# EAGLE design Arduino_NMEA_TestBoard (EAGLE 9.5.2)

## Sheet 1 of 2
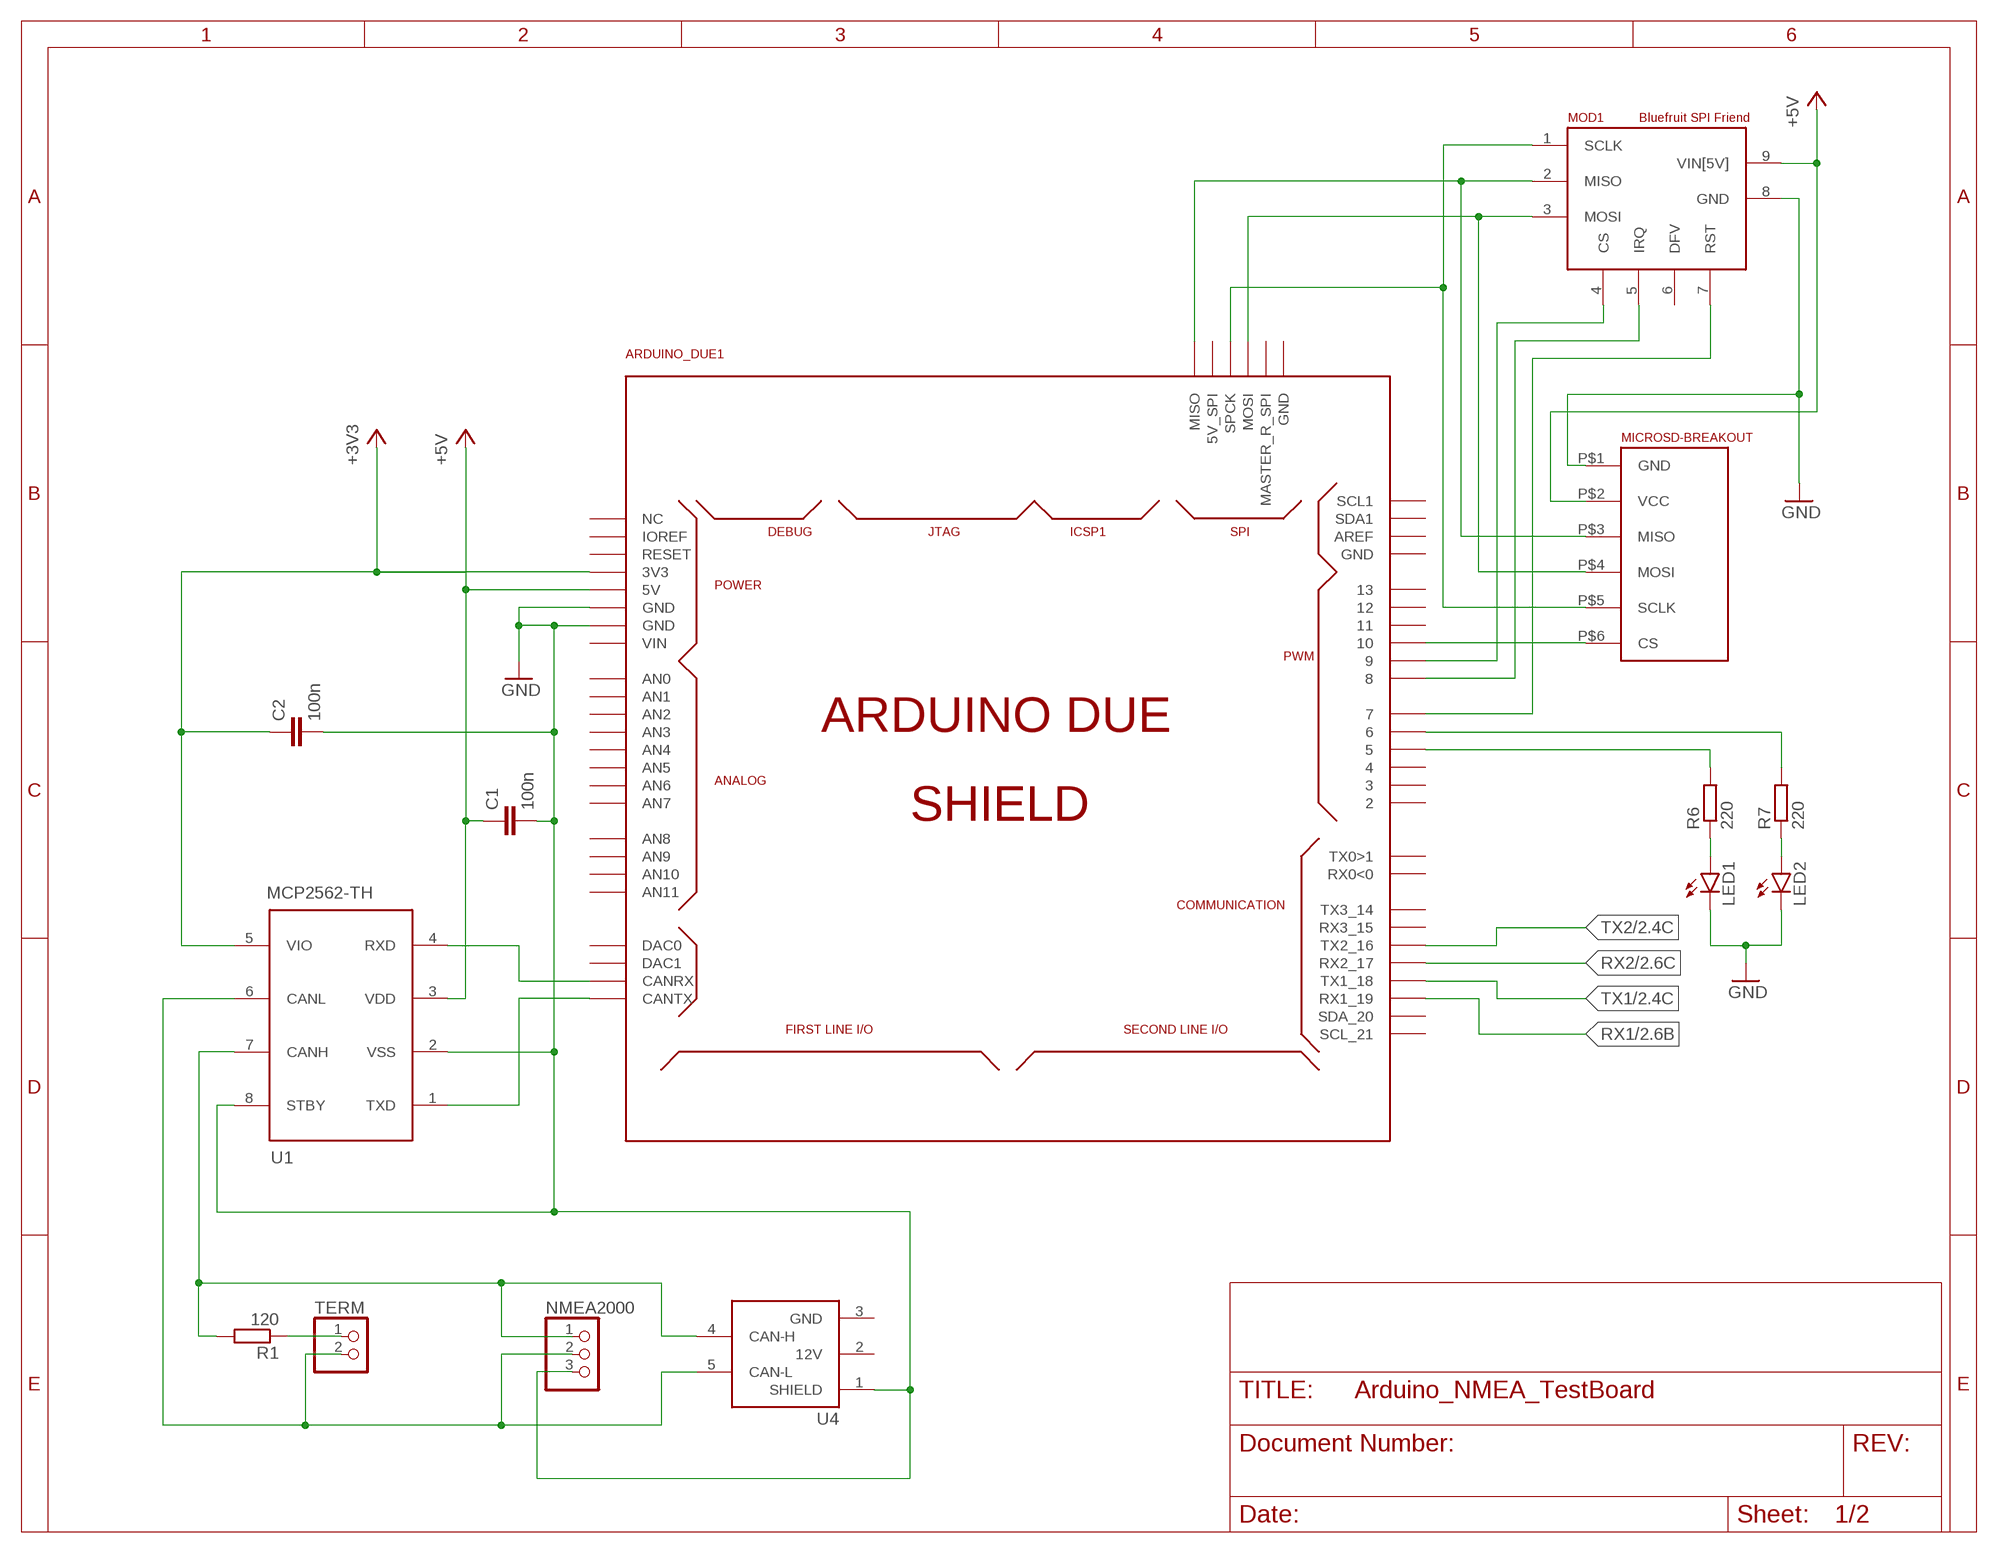
[diagram p0: schematic, sheet 1]

### Parts
ARDUINO_DUE1  ARDUINO_DUE_SHIELD  [ARDUINO_DUE_SHIELD]
C1  100n  C-EU050-025X075  [C050-025X075]
C2  100n  C-EU050-025X075  [C050-025X075]
LED1  LED5MM  [LED5MM]
LED2  LED5MM  [LED5MM]
MICROSD-BREAKOUT  MICROSD-BREAKOUT  [MICROSD-BREAKOUT]
MOD1  BLUEFRUIT-SPI-FRIEND  [BLE_SPIFRIEND]
NMEA2000  PINHD-1X3  [1X03]
R1  120  R-EU_0207/10  [0207/10]
R6  220  R-EU_0207/10  [0207/10]
R7  220  R-EU_0207/10  [0207/10]
TERM  PINHD-1X2  [1X02]
U1  MCP2562-TH  [DIP8]
U4  NMEA2000-TOPSIDE  [NMEA2000-TOPSIDE]

### Nets
+3V3: ARDUINO_DUE1.3V3 C2.1 U1.5(VIO) ; also sheet 2
+5V: ARDUINO_DUE1.5V0(5V) C1.1 MICROSD-BREAKOUT.P$2(VCC) MOD1.9(VIN[5V]) U1.3(VDD) ; also sheet 2
GND: ARDUINO_DUE1.GND ARDUINO_DUE1.GND_1(GND) C1.2 C2.2 LED1.K(C) LED2.K(C) MICROSD-BREAKOUT.P$1(GND) MOD1.8(GND) NMEA2000.3 U1.2(VSS) U1.8(STBY) U4.1(SHIELD) ; also sheet 2
N$2: ARDUINO_DUE1.SPCK MICROSD-BREAKOUT.P$5(SCLK) MOD1.1(SCLK)
N$3: ARDUINO_DUE1.CANRX U1.4(RXD)
N$4: ARDUINO_DUE1.CANTX U1.1(TXD)
N$5: NMEA2000.2 TERM.2 U1.6(CANL) U4.5(CAN-L)
N$6: NMEA2000.1 R1.2 U1.7(CANH) U4.4(CAN-H)
N$7: ARDUINO_DUE1.MISO MICROSD-BREAKOUT.P$3(MISO) MOD1.2(MISO)
N$8: ARDUINO_DUE1.MOSI MICROSD-BREAKOUT.P$4(MOSI) MOD1.3(MOSI)
N$10: R1.1 TERM.1
N$12: ARDUINO_DUE1.10 MICROSD-BREAKOUT.P$6(CS)
N$13: ARDUINO_DUE1.9 MOD1.4(CS)
N$14: ARDUINO_DUE1.8 MOD1.5(IRQ)
N$15: ARDUINO_DUE1.7 MOD1.7(RST)
N$25: ARDUINO_DUE1.5 R6.2
N$27: ARDUINO_DUE1.6 R7.2
N$31: LED1.A R6.1
N$32: LED2.A R7.1
RX1: ARDUINO_DUE1.19(RX1_19) ; also sheet 2
RX2: ARDUINO_DUE1.17(RX2_17) ; also sheet 2
TX1: ARDUINO_DUE1.18(TX1_18) ; also sheet 2
TX2: ARDUINO_DUE1.16(TX2_16) ; also sheet 2
Unconnected: ARDUINO_DUE1.0(RX0<0) ARDUINO_DUE1.1(TX0>1) ARDUINO_DUE1.2 ARDUINO_DUE1.3 ARDUINO_DUE1.4 ARDUINO_DUE1.5V_2(5V_SPI) ARDUINO_DUE1.11 ARDUINO_DUE1.12 ARDUINO_DUE1.13 ARDUINO_DUE1.14(TX3_14) ARDUINO_DUE1.15(RX3_15) ARDUINO_DUE1.20(SDA_20) ARDUINO_DUE1.21(SCL_21) ARDUINO_DUE1.A0(AN0) ARDUINO_DUE1.A1(AN1) ARDUINO_DUE1.A2(AN2) ARDUINO_DUE1.A3(AN3) ARDUINO_DUE1.A4(AN4) ARDUINO_DUE1.A5(AN5) ARDUINO_DUE1.A6(AN6) ARDUINO_DUE1.A7(AN7) ARDUINO_DUE1.A8(AN8) ARDUINO_DUE1.A9(AN9) ARDUINO_DUE1.A10(AN10) ARDUINO_DUE1.A11(AN11) ARDUINO_DUE1.AREF ARDUINO_DUE1.DAC0 ARDUINO_DUE1.DAC1 ARDUINO_DUE1.GND_4(GND) ARDUINO_DUE1.GND_5(GND) ARDUINO_DUE1.IOREF ARDUINO_DUE1.MASTER_RESET_SPI(MASTER_R_SPI) ARDUINO_DUE1.NC_2(NC) ARDUINO_DUE1.RESET ARDUINO_DUE1.SCL1 ARDUINO_DUE1.SDA1 ARDUINO_DUE1.VIN MOD1.6(DFV) U4.2(12V) U4.3(GND)

## Sheet 2 of 2
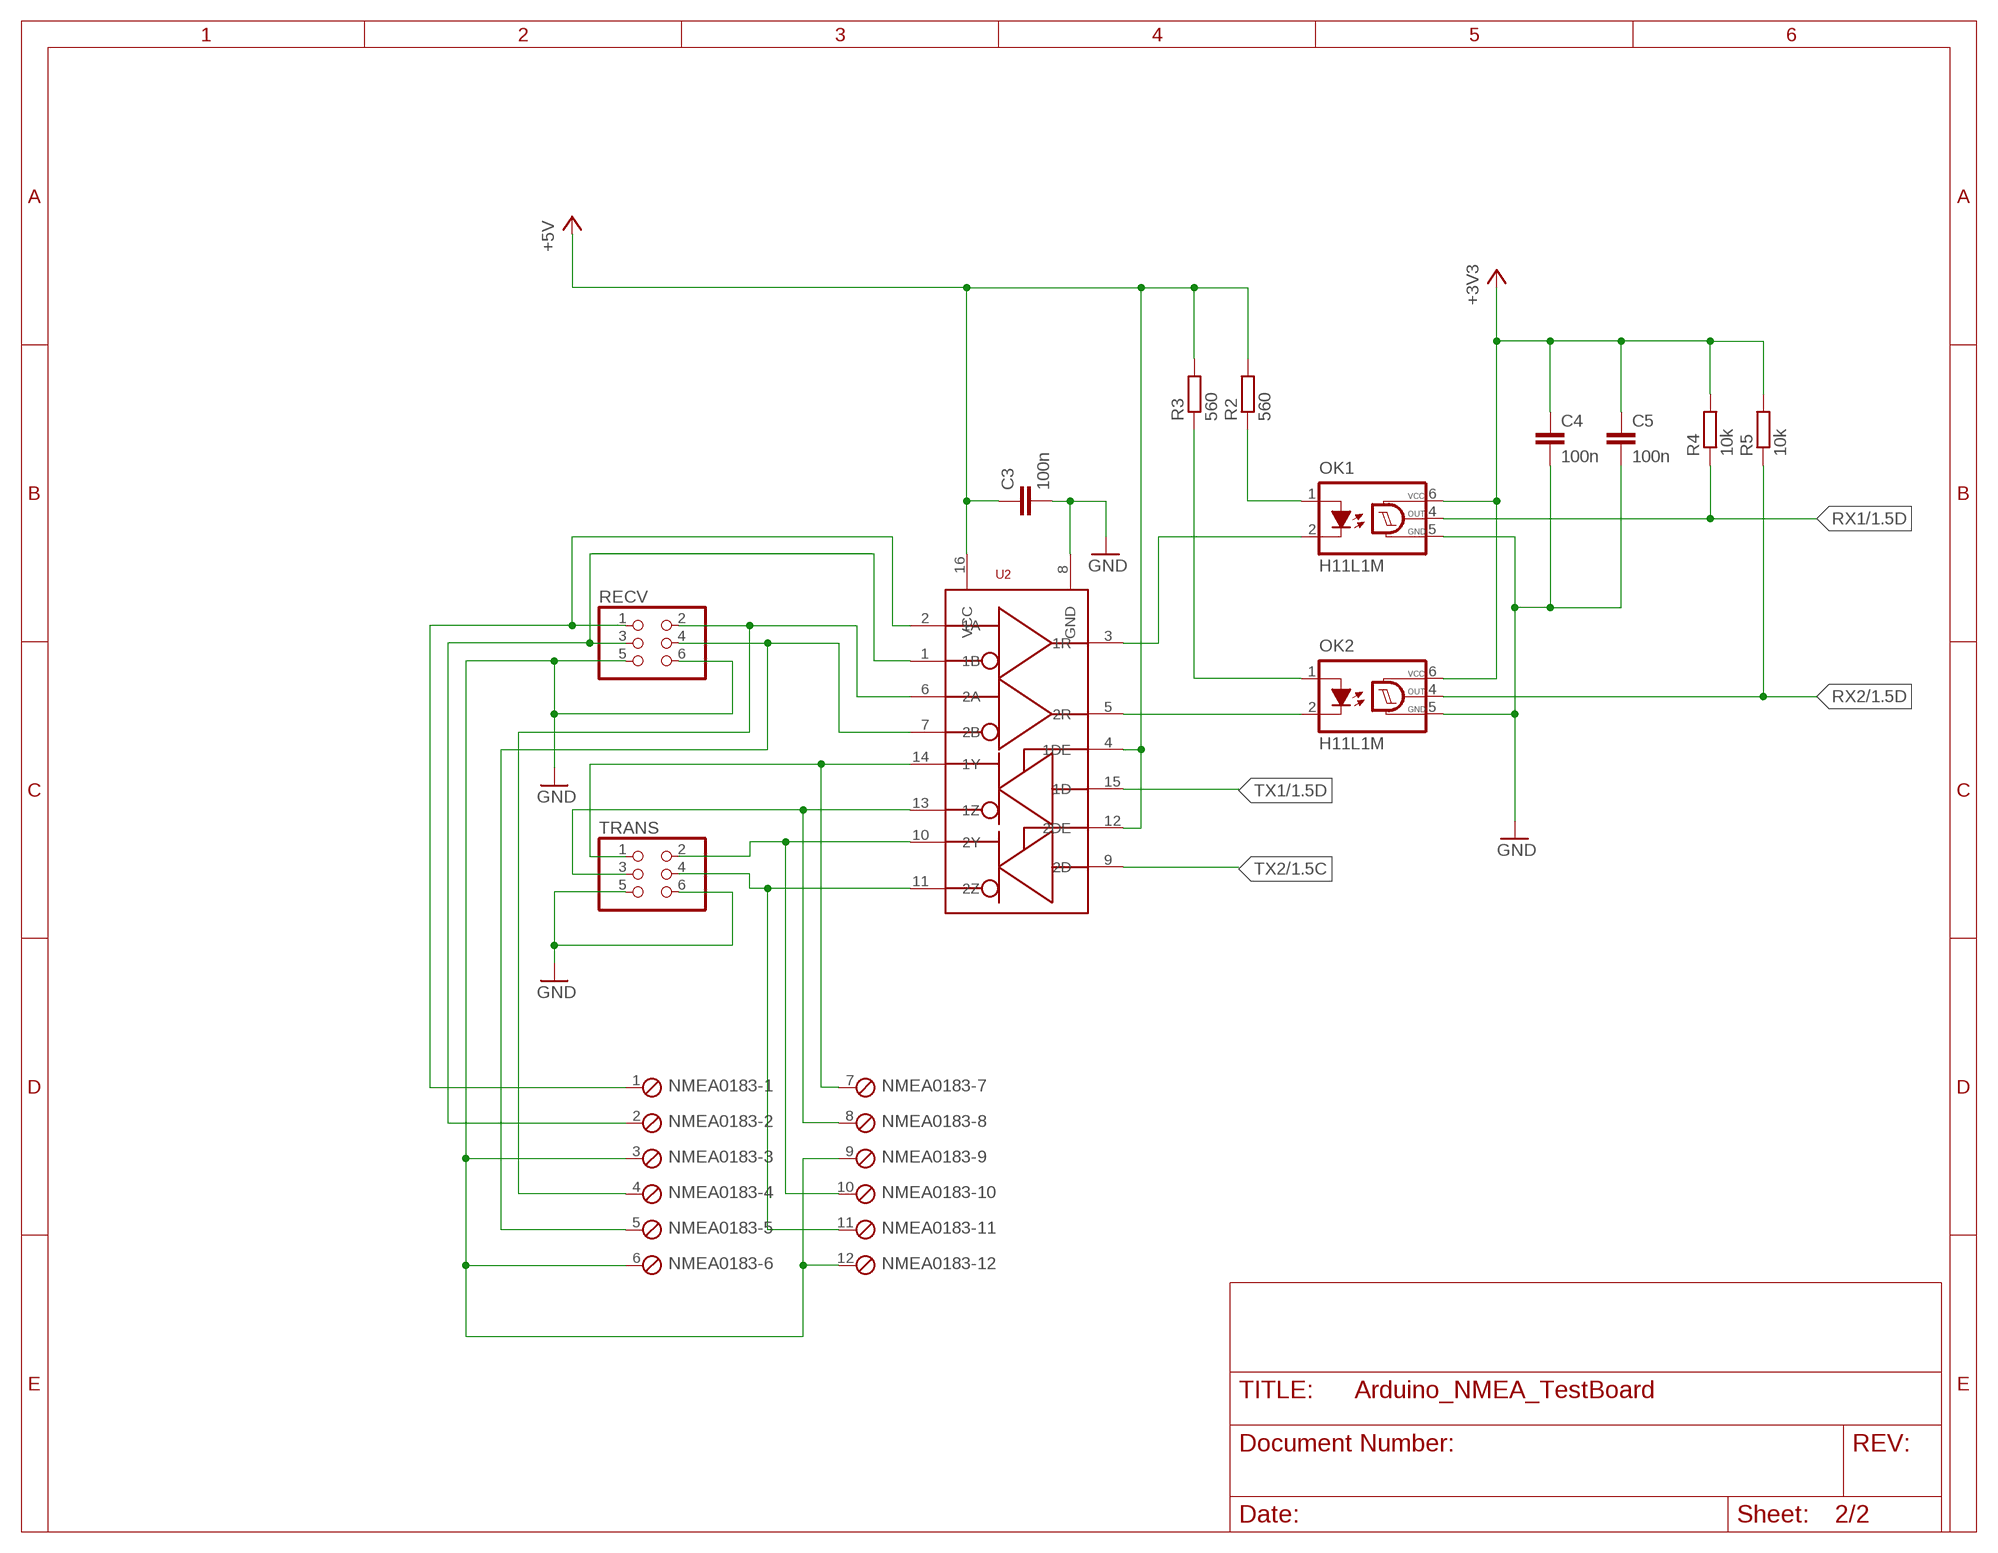
[diagram p1: schematic, sheet 2]

### Parts
C3  100n  C-EU050-025X075  [C050-025X075]
C4  100n  C-EU050-025X075  [C050-025X075]
C5  100n  C-EU050-025X075  [C050-025X075]
NMEA0183  MPT12  [12POL254]
OK1  H11L1M  [DIL06]
OK2  H11L1M  [DIL06]
R2  560  R-EU_0207/10  [0207/10]
R3  560  R-EU_0207/10  [0207/10]
R4  10k  R-EU_0207/10  [0207/10]
R5  10k  R-EU_0207/10  [0207/10]
RECV  PINHD-2X3  [2X03]
TRANS  PINHD-2X3  [2X03]
U2  SN65C1168  [DIP16]

### Nets
+3V3: C4.1 C5.1 OK1.6(VCC) OK2.6(VCC) R4.2 R5.2 ; also sheet 1
+5V: C3.1 R2.2 R3.2 U2.4(1DE) U2.12(2DE) U2.16(VCC) ; also sheet 1
GND: C3.2 C4.2 C5.2 NMEA0183.3 NMEA0183.6 NMEA0183.9 NMEA0183.12 OK1.5(GND) OK2.5(GND) RECV.5 RECV.6 TRANS.5 TRANS.6 U2.8(GND) ; also sheet 1
N$1: OK2.2(C) U2.5(2R)
N$17: OK1.2(C) U2.3(1R)
N$18: OK1.1(A) R2.1
N$19: OK2.1(A) R3.1
N$20: NMEA0183.1 RECV.1 U2.2(1A)
N$21: NMEA0183.2 RECV.3 U2.1(1B)
N$22: NMEA0183.4 RECV.2 U2.6(2A)
N$23: NMEA0183.5 RECV.4 U2.7(2B)
N$24: NMEA0183.8 TRANS.3 U2.13(1Z)
N$26: NMEA0183.10 TRANS.2 U2.10(2Y)
N$28: NMEA0183.7 TRANS.1 U2.14(1Y)
N$30: NMEA0183.11 TRANS.4 U2.11(2Z)
RX1: OK1.4(OUT) R4.1 ; also sheet 1
RX2: OK2.4(OUT) R5.1 ; also sheet 1
TX1: U2.15(1D) ; also sheet 1
TX2: U2.9(2D) ; also sheet 1

## Library data of the parts
ARDUINO_DUE1 = arduino_due_shield:ARDUINO_DUE_SHIELD
C1-C5 = rcl:C-EU: CAPACITOR, European symbol; SPICEPREFIX: C
LED1 LED2 = led:LED: LED OSRAM: - CHIPLED LG R971, LG N971, LY N971, LG Q971, LY Q971, LO R971, LY R971 LH N974, LH R974 LS Q976, LO Q976, LY Q976 LO Q996 - Hyper CHIPLED LW Q18S LB Q993, LB Q99A, LB R99A - SideLED LS A670, LO A670, LY A670, LG A670, LP A670 LB A673, LV A673, LT A673, LW A673 LH A674 LY A675 LS A676, LA A676, LO A676, LY A676, LW A676 LS A679, LY A679, LG A679 - Hyper Micro SIDELED® LS Y876, LA Y876, LO Y876, LY Y876 LT Y87S - SmartLED LW L88C, LW L88S LB L89C, LB L89S, LG L890 LS L89K, LO L89K, LY L89K LS L896, LA L896, LO L896, LY L896 - TOPLED LS T670, LO T670, LY T670, LG T670, LP T670 LSG T670, LSP T670, LSY T670, LOP T670, LYG T670 LG T671, LOG T671, LSG T671 LB T673, LV T673, LT T673, LW T673 LH T674 LS T676, LA T676, LO T676, LY T676, LB T676, LH T676, LSB T676, LW T676 LB T67C, LV T67C, LT T67C, LS T67K, LO T67K, LY T67K, LW E67C LS E67B, LA E67B, LO E67B, LY E67B, LB E67C, LV E67C, LT E67C LW T67C LS T679, LY T679, LG T679 LS T770, LO T770, LY T770, LG T770, LP T770 LB T773, LV T773, LT T773, LW T773 LH T774 LS E675, LA E675, LY E675, LS T675 LS T776, LA T776, LO T776, LY T776, LB T776 LHGB T686 LT T68C, LB T68C - Hyper Mini TOPLED® LB M676 - Mini TOPLED Santana® LG M470 LS M47K, LO M47K, LY M47K Source: http://www.osram.convergy.de LUXEON: - LUMILED® LXK2-PW12-R00, LXK2-PW12-S00, LXK2-PW14-U00, LXK2-PW14-V00 LXK2-PM12-R00, LXK2-PM12-S00, LXK2-PM14-U00 LXK2-PE12-Q00, LXK2-PE12-R00, LXK2-PE12-S00, LXK2-PE14-T00, LXK2-PE14-U00 LXK2-PB12-K00, LXK2-PB12-L00, LXK2-PB12-M00, LXK2-PB14-N00, LXK2-PB14-P00, LXK2-PB14-Q00 LXK2-PR12-L00, LXK2-PR12-M00, LXK2-PR14-Q00, LXK2-PR14-R00 LXK2-PD12-Q00, LXK2-PD12-R00, LXK2-PD12-S00 LXK2-PH12-R00, LXK2-PH12-S00 LXK2-PL12-P00, LXK2-PL12-Q00, LXK2-PL12-R00 Source: www.luxeon.com KINGBRIGHT: KA-3528ASYC Source: www.kingbright.com
MICROSD-BREAKOUT = sb2030_logger:MICROSD-BREAKOUT
MOD1 = sb2030_logger:BLUEFRUIT-SPI-FRIEND
NMEA0183 = con-phoenix-254:MPT12: PHOENIX CONNECTOR; OC_FARNELL: unknown; OC_NEWARK: unknown
NMEA2000 = pinhead:PINHD-1X3: PIN HEADER
OK1 OK2 = optocoupler:H11L*M: 6-Pin DIP Optocoupler Source: http://www.fairchildsemi.com/ds/H1/H11L2-M.pdf; MF: FAIRCHILD SEMICONDUCTOR; MPN: H11L1-M; OC_FARNELL: 1021127; OC_NEWARK: 72K8643
R1-R7 = rcl:R-EU_: RESISTOR, European symbol; SPICEPREFIX: R
RECV TRANS = pinhead:PINHD-2X3: PIN HEADER
TERM = pinhead:PINHD-1X2: PIN HEADER
U1 = sb2030_logger:MCP2562-TH
U2 = sb2030_logger:SN65C1168
U4 = sb2030_logger:NMEA2000-TOPSIDE

## Board
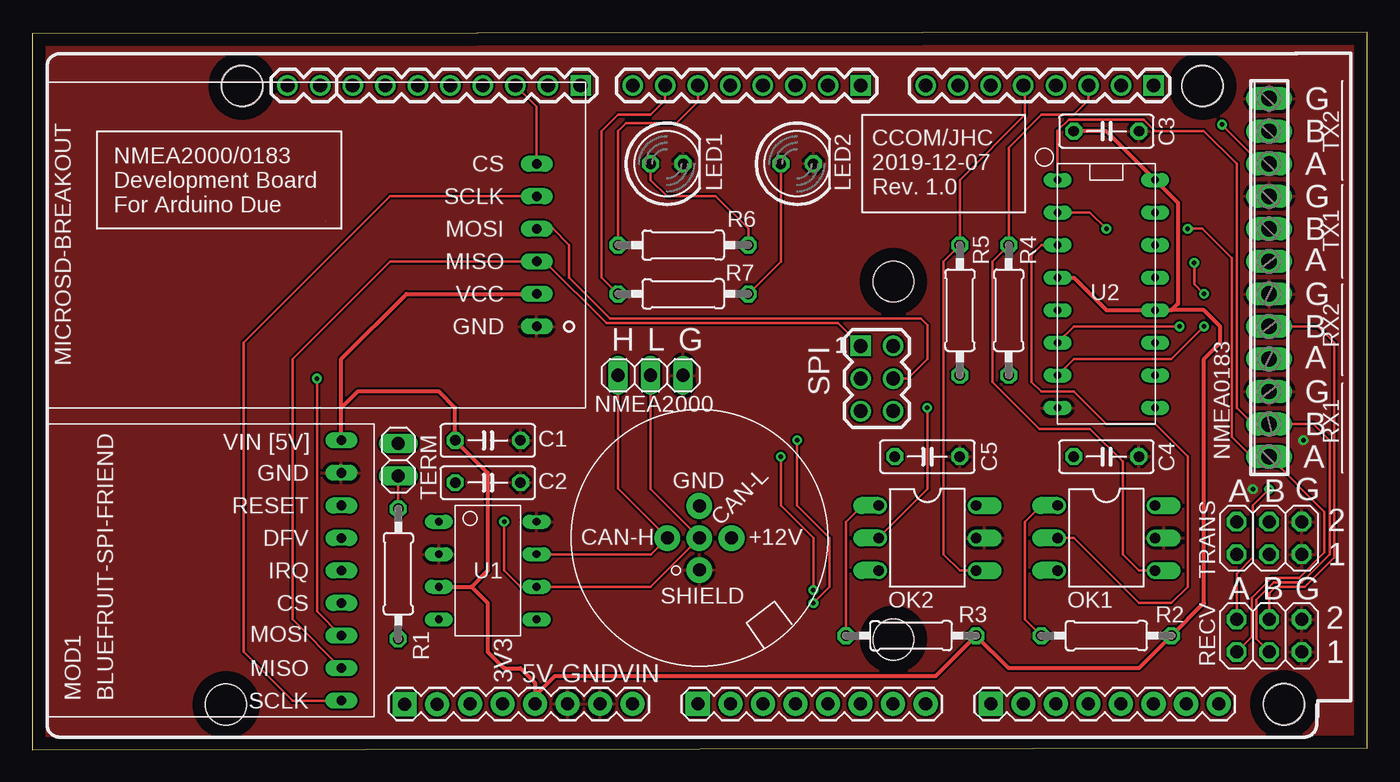
[diagram p2: board, top side]
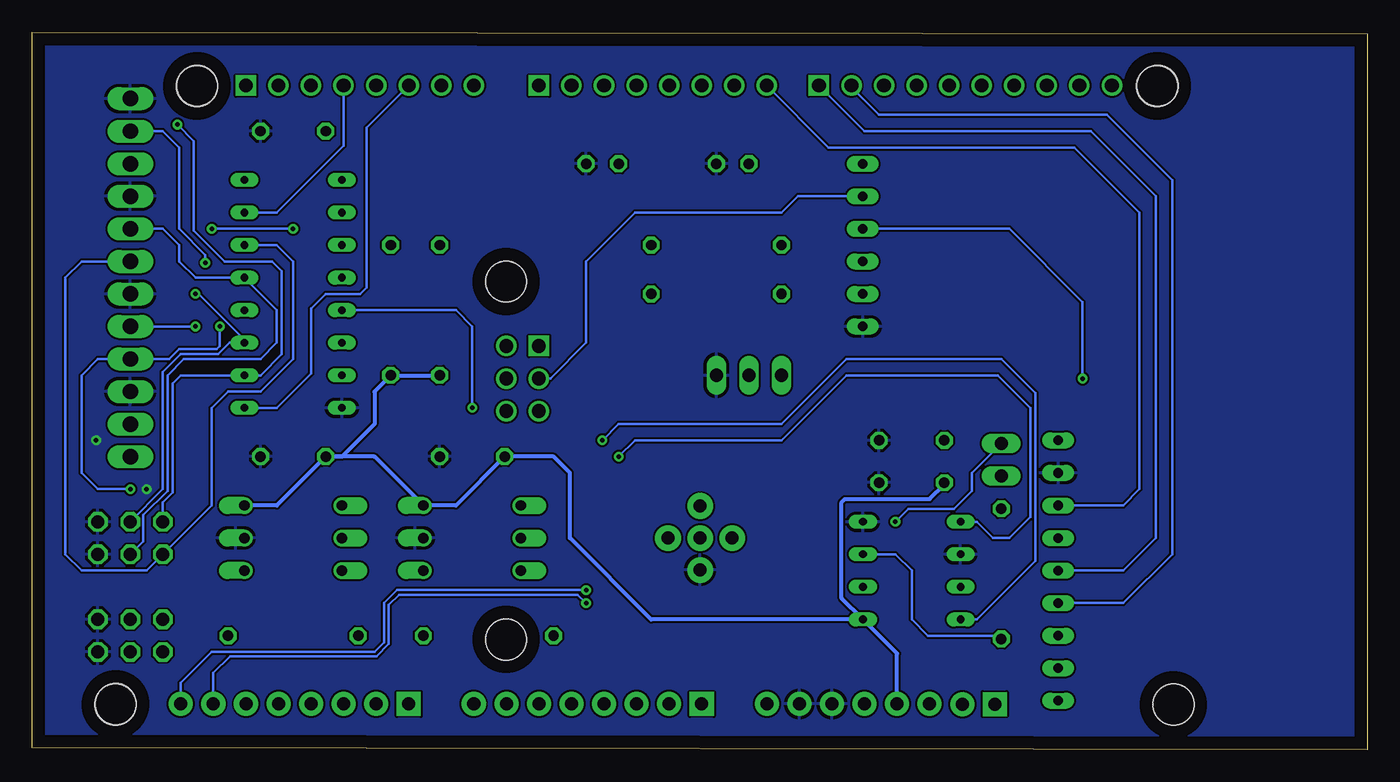
[diagram p3: board, bottom side, seen from below]

Size 104.19 x 56 mm. Coordinates in mm from the lower left corner, seen from the top.
Outline: 0,0 104.19,0.13 104.19,56 0,55.87 0,0
Copper layers (1*16): Top 0.035mm / dielectric 1.5mm / Bottom 0.035mm
Design rules "default": minimum track width 6mil, minimum drill 0.35mm, track to track 6mil, track to pad 6mil, pad to pad 6mil, via to via 6mil, smd to smd 6mil, copper to edge 40mil, drill to drill 6mil, minimum pad ring 10mil, minimum via ring 8mil, stop-mask expansion 4mil, vias tented up to drill 0mil, thermal gap 10mil

### Footprints (pad centres in the part's own frame; a part is rotated, then mirrored left to right if it is on the bottom)
ARDUINO_DUE_SHIELD = drill 1.067 square: 0 63.373,51.816; 8 41.529,51.816; 21 86.233,51.816; MISO 63.373,31.496 | drill 1.067: 1 60.833,51.816; 2 58.293,51.816; 3 55.753,51.816; 4 53.213,51.816; 5 50.673,51.816; 5V_2 65.913,31.496; 6 48.133,51.816; 7 45.593,51.816; 9 38.989,51.816; 10 36.449,51.816; 11 33.909,51.816; 12 31.369,51.816; 13 28.829,51.816; 14 68.453,51.816; 15 70.993,51.816; 16 73.533,51.816; 17 76.073,51.816; 18 78.613,51.816; 19 81.153,51.816; 20 83.693,51.816; AREF 23.749,51.816; GND_4 26.289,51.816; GND_5 65.913,26.416; MASTER_RESET_SPI 63.373,26.416; MOSI 65.913,28.956; SCL1 18.669,51.816; SDA1 21.209,51.816; SPCK 63.373,28.956 | drill 1.016 pad 1.88: 3V3 35.433,3.556; 5V0 37.973,3.556; A1 53.213,3.556; A2 55.753,3.556; A3 58.293,3.556; A4 60.833,3.556; A5 63.373,3.556; A6 65.913,3.556; A7 68.453,3.556; A9 76.073,3.556; A10 78.613,3.556; A11 81.153,3.556; CANRX 88.773,3.556; CANTX 91.313,3.556; DAC0 83.693,3.556; DAC1 86.233,3.556; GND 40.513,3.556; GND_1 43.053,3.556; IOREF 30.346,3.543; RESET 32.893,3.555; VIN 45.593,3.556 | drill 1.016 pad 1.88 square: A0 50.673,3.556; A8 73.533,3.556; NC_2 27.806,3.543 | hole 3.2: 15.113,51.816; 90.043,51.816; 96.393,3.556; 96.418,3.505; 15.138,51.765; 90.068,51.765; 13.868,3.505; 65.938,36.525; 65.938,8.585
C050-025X075 = drill 0.813 octagon: 1 -2.54,0; 2 2.54,0
LED5MM = drill 0.813 octagon: A -1.27,0; K 1.27,0
MICROSD-BREAKOUT = drill 0.75 long: P$1 -6.35,-17.78; P$2 -3.81,-17.78; P$3 -1.27,-17.78; P$4 1.27,-17.78; P$5 3.81,-17.78; P$6 6.35,-17.78
BLE_SPIFRIEND = drill 0.75 long: 1 -10.16,-10.16; 2 -7.62,-10.16; 3 -5.08,-10.16; 4 -2.54,-10.16; 5 0,-10.16; 6 2.54,-10.16; 7 5.08,-10.16; 8 7.62,-10.16; 9 10.16,-10.16
12POL254 = drill 1.2 long: 1 -13.97,0; 2 -11.43,0; 3 -8.89,0; 4 -6.35,0; 5 -3.81,0; 6 -1.27,0; 7 1.27,0; 8 3.81,0; 9 6.35,0; 10 8.89,0; 11 11.43,0; 12 13.97,0
1X03 = drill 1.016 long: 1 -2.54,0; 2 0,0; 3 2.54,0
DIL06 = drill 0.813 offset: 1 -2.54,-3.81; 2 0,-3.81; 3 2.54,-3.81; 4 2.54,3.81; 5 0,3.81; 6 -2.54,3.81
0207/10 = drill 0.813 octagon: 1 -5.08,0; 2 5.08,0
2X03 = drill 1.016 octagon: 1 -2.54,-1.27; 2 -2.54,1.27; 3 0,-1.27; 4 0,1.27; 5 2.54,-1.27; 6 2.54,1.27
1X02 = drill 1.016 long: 1 -1.27,0; 2 1.27,0
DIP8 = drill 0.6 long: 1 -3.81,3.81; 2 -3.81,1.27; 3 -3.81,-1.27; 4 -3.81,-3.81; 5 3.81,-3.81; 6 3.81,-1.27; 7 3.81,1.27; 8 3.81,3.81
DIP16 = drill 0.6 long: 1 -3.81,8.89; 2 -3.81,6.35; 3 -3.81,3.81; 4 -3.81,1.27; 5 -3.81,-1.27; 6 -3.81,-3.81; 7 -3.81,-6.35; 8 -3.81,-8.89; 9 3.81,-8.89; 10 3.81,-6.35; 11 3.81,-3.81; 12 3.81,-1.27; 13 3.81,1.27; 14 3.81,3.81; 15 3.81,6.35; 16 3.81,8.89
NMEA2000-TOPSIDE = drill 1 pad 2: 1 0,-2.5; 2 2.5,0; 3 0,2.5; 4 -2.5,0; 5 0,0

### Placement (x,y rotation side)
ARDUINO_DUE1  1.27,0 0 top
C1  35.56,24.13 0 top
C2  35.56,20.83 0 top
C3  83.82,48.26 0 top
C4  83.82,22.86 0 top
C5  69.85,22.86 0 top
LED1  49.53,45.72 0 top
LED2  59.69,45.72 0 top
MICROSD-BREAKOUT  21.59,39.37 90 top
MOD1  13.97,13.97 90 top
NMEA0183  96.52,36.83 90 top
NMEA2000  48.26,29.21 0 top
OK1  83.82,16.51 270 top
OK2  69.85,16.51 270 top
R1  28.57,13.72 270 top
R2  83.82,8.89 0 top
R3  68.58,8.89 0 top
R4  76.2,34.29 270 top
R5  72.39,34.29 270 top
R6  50.8,39.37 180 top
R7  50.8,35.56 180 top
RECV  96.52,8.89 0 top
TERM  28.57,22.61 90 top
TRANS  96.52,16.51 0 top
U1  35.56,13.97 0 top
U2  83.82,35.56 0 top
U4  52.07,16.51 0 top

### Tracks (layer width: path | path; a pad name or v marks a point on that pad's centre or on a via)
+3V3
  Bottom 0.203: 33.02,20.7 C2.1
  Bottom 0.305: 33.02,20.7 34.16,19.56 40.77,19.56 41.02,19.3 41.02,11.81 U1.5 | ARDUINO_DUE1.3V3 36.7,7.49 U1.5 | U1.5 55.88,10.16 62.23,16.51 62.23,21.59 63.5,22.86 C5.1 71.12,19.05 OK2.6 77.47,22.86 C4.1 | OK1.6 85.09,19.05 C4.1 | C4.1 80.01,22.86 77.47,25.4 77.47,27.94 R4.2 R5.2
+5V
  Top 0.305: MOD1.9 24.13,26.67 | 24.13,26.67 24.13,30.48 29.21,35.56 MICROSD-BREAKOUT.P$2 | 24.13,26.67 25.4,27.94 31.75,27.94 33.02,26.67 C1.1 35.56,21.59 35.56,13.97 34.29,12.7 | 34.29,12.7 35.56,11.43 35.56,7.62 36.83,6.35 38.1,6.35 39.24,5.21 ARDUINO_DUE1.5V0 39.24,4.19 40.77,5.71 70.48,5.71 R3.2 76.2,6.35 86.36,6.35 R2.2 91.44,11.43 91.44,30.48 92.71,31.75 92.71,33.02 91.44,34.29 88.9,34.29 | U1.3 34.29,12.7 | C3.1 83.82,48.26 U2.16 89.41,42.67 89.41,34.8 88.9,34.29 | U2.4 81.28,36.83 83.82,34.29 U2.12 88.9,34.29
GND  (via drill 0.35)
  other vias: 95.25,20.32 99.19,24.13
  pour Bottom: 0,55.88 105.41,55.88 105.41,0 0,0
  pour Top: 0,55.88 105.41,55.88 105.41,0 0,0
N$1  (via drill 0.35)
  Top 0.203: v69.85,26.67 69.85,20.32 OK2.2
  Bottom 0.203: U2.5 71.12,34.29 69.85,33.02 v69.85,26.67
N$2
  Top 0.203: MICROSD-BREAKOUT.P$5 27.94,43.18 16.51,31.75 16.51,7.62 20.32,3.81 MOD1.1
  Bottom 0.203: MICROSD-BREAKOUT.P$5 44.45,43.18 45.72,41.91 57.15,41.91 60.96,38.1 60.96,31.75 63.75,28.96 ARDUINO_DUE1.SPCK
N$3  (via drill 0.35)
  Top 0.203: v60.96,11.43 62.23,12.7 62.23,16.51 59.69,19.05 v59.69,24.13
  Bottom 0.203: U1.4 30.48,10.16 25.91,14.73 25.91,27.81 28.57,30.48 40.64,30.48 45.72,25.4 58.42,25.4 v59.69,24.13 | ARDUINO_DUE1.CANRX 90.04,5.97 88.75,7.26 77.32,7.26 76.35,8.23 76.35,11.28 75.55,12.09 61.62,12.09 v60.96,11.43
N$4  (via drill 0.35)
  Top 0.203: v60.96,12.45 60.96,16.51 58.42,19.05 v58.42,22.86
  Bottom 0.203: U1.1 30.48,17.78 29.21,16.51 27.94,16.51 26.29,18.16 26.29,26.67 28.83,29.21 40.64,29.21 45.72,24.13 57.15,24.13 v58.42,22.86 | ARDUINO_DUE1.CANTX 92.58,5.21 90.17,7.62 77.47,7.62 76.71,8.38 76.71,11.43 75.69,12.45 v60.96,12.45
N$5  (via drill 0.35)
  Top 0.203: v36.83,17.78 36.83,13.97 38.1,12.7 U1.6 48.26,12.7 U4.5 48.26,20.32 NMEA2000.2
  Bottom 0.203: TERM.2 30.86,21.59 30.86,20.19 32.26,18.8 35.81,18.8 v36.83,17.78
N$6
  Top 0.203: U1.7 48.3,15.24 U4.4 45.72,20.36 NMEA2000.1
  Bottom 0.203: R1.2 28.83,8.89 34.29,8.89 35.56,10.16 35.56,13.97 36.83,15.24 U1.7
N$7
  Top 0.203: ARDUINO_DUE1.MISO 62.87,33.27 44.83,33.27 40.01,38.1 MICROSD-BREAKOUT.P$3 27.94,38.1 20.32,30.48 20.32,10.16 MOD1.2
N$8  (via drill 0.35)
  Top 0.203: MICROSD-BREAKOUT.P$4 40.64,40.64 41.91,39.37 41.91,36.83 45.09,33.66 69.34,33.66 69.85,33.15 69.85,30.48 68.33,28.96 ARDUINO_DUE1.MOSI | v22.23,28.96 22.23,10.79 MOD1.3
  Bottom 0.203: MICROSD-BREAKOUT.P$4 27.94,40.64 22.23,34.92 v22.23,28.96
N$10
  Top 0.203: R1.1 TERM.1
N$12
  Top 0.203: ARDUINO_DUE1.10 39.37,50.16 MICROSD-BREAKOUT.P$6
N$13
  Bottom 0.203: ARDUINO_DUE1.9 40.26,51.69 38.1,49.53 20.32,49.53 15.24,44.45 15.24,15.24 19.05,11.43 MOD1.4
N$14
  Bottom 0.203: ARDUINO_DUE1.8 39.24,48.26 21.59,48.26 16.51,43.18 16.51,16.51 19.05,13.97 MOD1.5
N$15
  Bottom 0.203: ARDUINO_DUE1.7 42.04,46.99 22.86,46.99 17.78,41.91 17.78,20.32 19.05,19.05 MOD1.7
N$17
  Top 0.203: U2.3 78.74,39.37 77.98,38.61 77.98,28.7 78.74,27.94 81.28,27.94 83.82,25.4 87.63,25.4 90.17,22.86 90.17,12.7 88.9,11.43 86.36,11.43 81.28,16.51 OK1.2
N$18
  Top 0.203: R2.1 77.47,10.16 77.47,17.78 78.74,19.05 OK1.1
N$19
  Top 0.203: R3.1 63.5,17.78 64.77,19.05 OK2.1
N$20  (via drill 0.35)
  Top 0.203: U2.2 82.55,41.91 v83.82,40.64 | v90.17,40.64 91.31,40.64 93.6,38.35 93.6,24.38 95.12,22.86 NMEA0183.1 100.84,18.54 100.84,15.37 98.88,13.41 96.73,13.41 95.15,11.83 95.15,8.79 RECV.1
  Bottom 0.203: v83.82,40.64 v90.17,40.64
N$21
  Top 0.203: RECV.3 95.5,8.64 95.5,11.68 96.88,13.06 99.06,13.06 101.24,15.24 101.24,24.13 99.97,25.4 NMEA0183.2 95.25,25.4 93.98,26.67 93.98,45.72 91.44,48.26 87.65,48.26 86.74,49.17 80.9,49.17 80.01,48.28 U2.1
N$22  (via drill 0.35)
  Top 0.203: U2.6 81.28,33.02 v89.53,33.02 | RECV.2 93.98,13.72 95.25,14.99 95.25,19.05 v96.52,20.32
  Bottom 0.203: v89.53,33.02 89.53,31.5 89.79,31.24 92.71,31.24 93.47,30.48 NMEA0183.4 99.06,30.48 100.33,29.21 100.33,21.59 99.06,20.32 v96.52,20.32
N$23  (via drill 0.35)
  Top 0.203: RECV.4 96.52,12.19 97.03,12.7 99.31,12.7 101.6,14.99 101.6,31.75 100.33,33.02 NMEA0183.5 | v91.44,33.02 88.9,30.48 81.28,30.48 U2.7
  Bottom 0.203: NMEA0183.5 v91.44,33.02
N$24
  Bottom 0.203: TRANS.3 95.5,16.26 95.5,18.29 93.62,20.17 93.62,29.21 92.35,30.48 86.36,30.48 85.09,31.75 85.09,34.29 U2.13 91.44,36.83 92.71,38.1 92.71,39.37 93.98,40.64 NMEA0183.8
N$25
  Top 0.203: R6.2 45.72,48.26 46.35,48.9 50.29,48.9 51.94,50.55 ARDUINO_DUE1.5
N$26  (via drill 0.35)
  Top 0.203: NMEA0183.10 95.89,45.72 v92.84,48.77
  Bottom 0.203: TRANS.2 93.98,19.3 93.22,20.07 93.22,28.57 92.58,29.21 U2.10 86.36,29.21 84.71,30.86 84.71,37.34 85.47,38.1 89.15,38.1 91.57,40.51 91.57,47.5 v92.84,48.77
N$27
  Top 0.203: R7.2 44.45,36.83 44.45,48.26 45.72,49.53 48.26,49.53 49.4,50.67 ARDUINO_DUE1.6
N$28
  Bottom 0.203: NMEA0183.7 100.33,38.1 101.6,36.83 101.6,15.24 100.33,13.97 95.25,13.97 TRANS.1 90.17,19.05 90.17,26.67 88.9,27.94 86.36,27.94 83.82,30.48 83.82,38.1 85.09,39.37 U2.14
N$30  (via drill 0.35)
  Top 0.203: v90.68,37.97 90.68,36.32 v91.44,35.56
  Bottom 0.203: TRANS.4 93.98,20.32 93.98,29.46 92.58,30.86 89.66,30.86 88.77,31.75 U2.11 87.63,32.01 91.18,35.56 v91.44,35.56 | NMEA0183.11 93.98,48.26 92.71,46.99 92.71,40.64 90.68,38.61 v90.68,37.97
N$31
  Top 0.203: R6.1 55.88,40.64 53.34,43.18 49.53,43.18 48.26,44.45 LED1.A
N$32
  Top 0.203: R7.1 58.42,38.1 LED2.A
RX1
  Top 0.203: ARDUINO_DUE1.19 82.42,50.67 81.28,49.53 78.74,49.53 76.2,46.99 R4.1 74.93,38.1 74.93,28.7 78.61,25.02 82.55,25.02 85.09,22.48 85.09,15.24 86.36,13.97 OK1.4
RX2
  Top 0.203: ARDUINO_DUE1.17 77.47,51.69 77.47,49.53 72.39,44.45 R5.1 71.12,38.1 71.12,15.24 72.39,13.97 OK2.4
TX1
  Bottom 0.203: U2.15 85.09,41.91 79.88,47.12 ARDUINO_DUE1.18
TX2
  Bottom 0.203: ARDUINO_DUE1.16 78.11,48.51 78.11,36.07 78.61,35.56 81.28,35.56 82.42,34.42 82.42,29.34 85.09,26.67 U2.9

### Text on the board
tPlace: G | B | TX2 | A | CCOM/JHC / 2019-12-07 / Rev. 1.0 | NMEA2000/0183 / Development Board / For Arduino Due | G | B | TX1 | A | G | B | H | L | G | RX2 | A | G | B | RX1 | A | A | B | G | 2 | 1 | A | B | G | 2 | 1